# EAGLE design V1 (EAGLE 8.5.1)
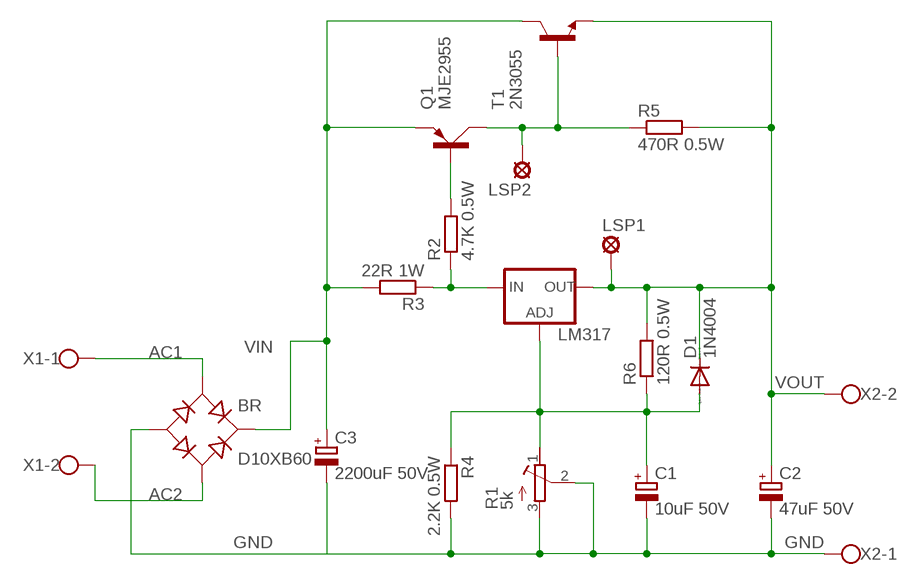
[diagram p0: schematic, sheet 1]

## Parts
BR  D10XB60  [DX10B60]
C1  10uF 50V  CPOL-EUE2.5-5  [E2,5-5]
C2  47uF 50V  CPOL-EUE5-8.5  [E5-8,5]
C3  2200uF 50V  CPOL-EUE7.5-18  [E7,5-18]
D1  1N4004  [DO41-10]
LM317  V_REG_317SINK  [TO220-ADJ]
LSP1  SE13  [SE13]
LSP2  SE13  [SE13]
Q1  MJE2955  [TO220AV]
R1  5k  R-TRIMMT93XA  [RTRIMT93XA]
R2  4.7K 0.5W  R-EU_0617/17  [0617/17]
R3  22R 1W  R-EU_0617/17  [0617/17]
R4  2.2K 0.5W  R-EU_0617/17  [0617/17]
R5  470R 0.5W  R-EU_0617/17  [0617/17]
R6  120R 0.5W  R-EU_0617/17  [0617/17]
T1  2N3055  [TO3]
X1  W237-102  [W237-102]
X2  W237-102  [W237-102]

## Nets
AC1: BR.AC1 X1.1
AC2: BR.AC2 X1.2
GND: BR.- C1.- C2.- C3.- R1.2(S) R1.3(A) R4.2 X2.1
N$2: LM317.IN R2.1 R3.1
N$3: Q1.B R2.2
N$4: LSP2.MP Q1.C R5.1 T1.B
N$6: C1.+ D1.A LM317.ADJ R1.1(E) R4.1 R6.1
VIN: BR.+ C3.+ Q1.E R3.2 T1.C T1.C/(C)
VOUT: C2.+ D1.C LM317.OUT LSP1.MP R5.2 R6.2 T1.E X2.2

## Library data of the parts
BR = dx10b60:D10XB60
C1 = rcl:CPOL-EU: POLARIZED CAPACITOR, European symbol; SPICEPREFIX: C
C2 C3 = rcl:CPOL-EU: POLARIZED CAPACITOR, European symbol
D1 = diode:1N4004: DIODE general purpose rectifier, 1 A
LM317 = SparkFun:V_REG_317: Voltage Regulator Standard LM317 adjustable voltage regulator. AOI (Adjust Output Input). Google 'LM317 Calculator' for easy to use app to get the two resistor values needed. 240/720 for 5V output. 240/390 for 3.3V output. Spark Fun Electronics SKU : COM-00527
LSP1 LSP2 = solpad:SE13: SOLDER PAD E1542, drill 1,3mm, distributor Buerklin, 07F815
Q1 = transistor-power:MJE2955: PNP TRANSISTOR
R1 = rcl:R-TRIMM: Trimm resistor; SPICEMODEL: X; SPICEPREFIXL: POT
R2-R6 = rcl:R-EU_: RESISTOR, European symbol; SPICEPREFIX: R
T1 = transistor:2N3055: NPN TRANSISTOR
X1 X2 = con-wago-500:W237-102: WAGO SCREW CLAMP; MPN: 237-102; OC_FARNELL: unknown; OC_NEWARK: 70K9898

## Board
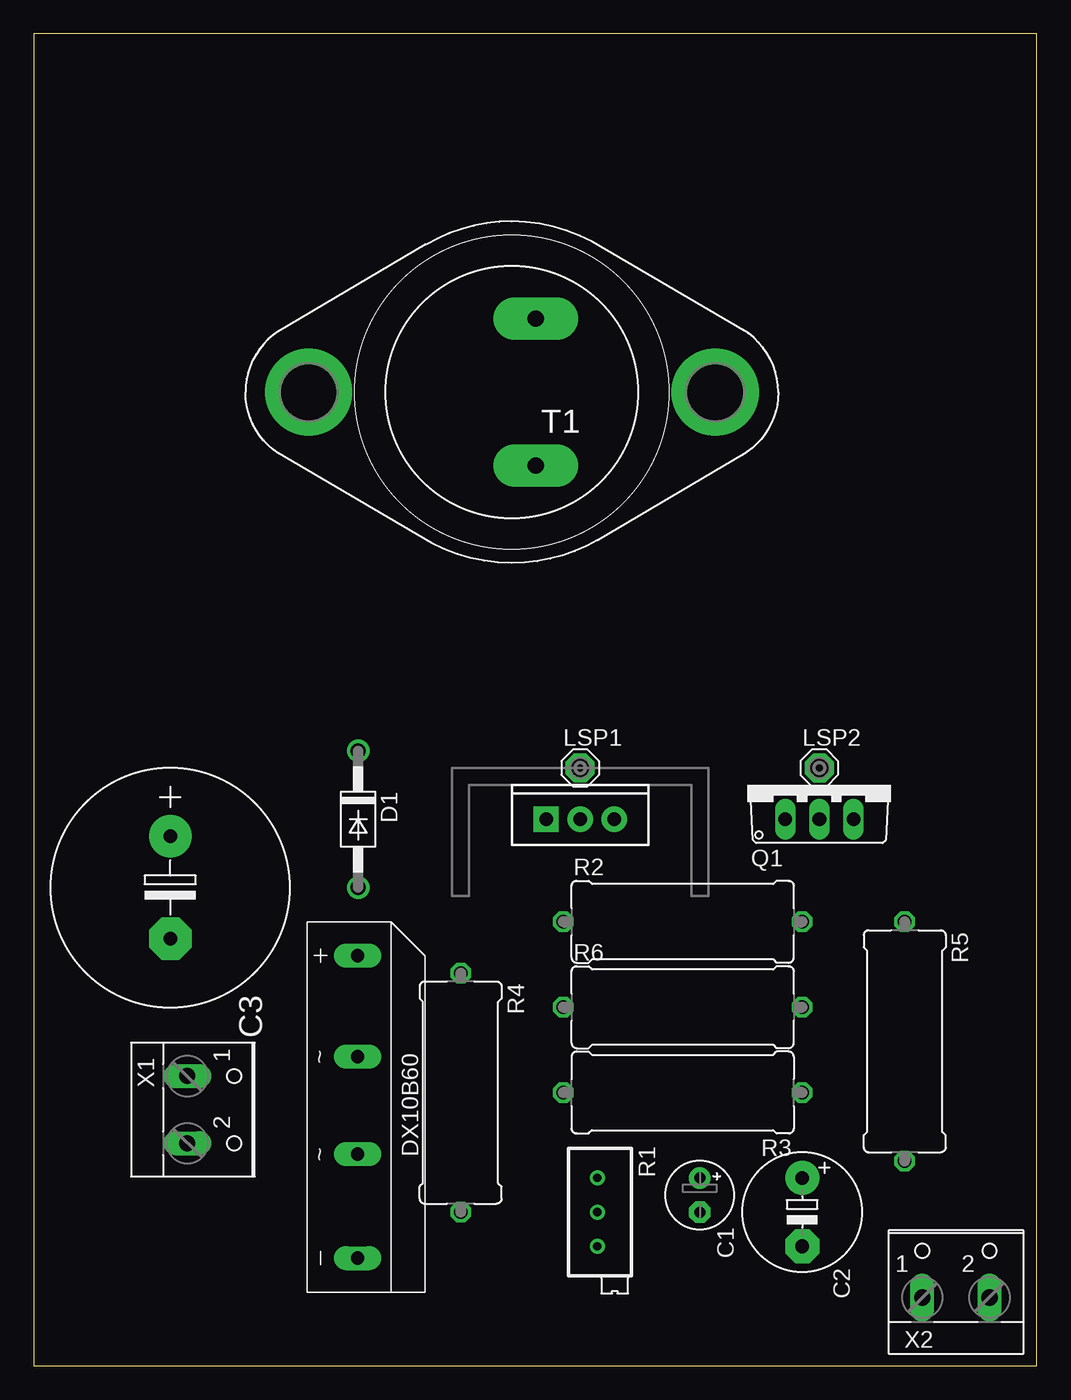
[diagram p1: board, top side]
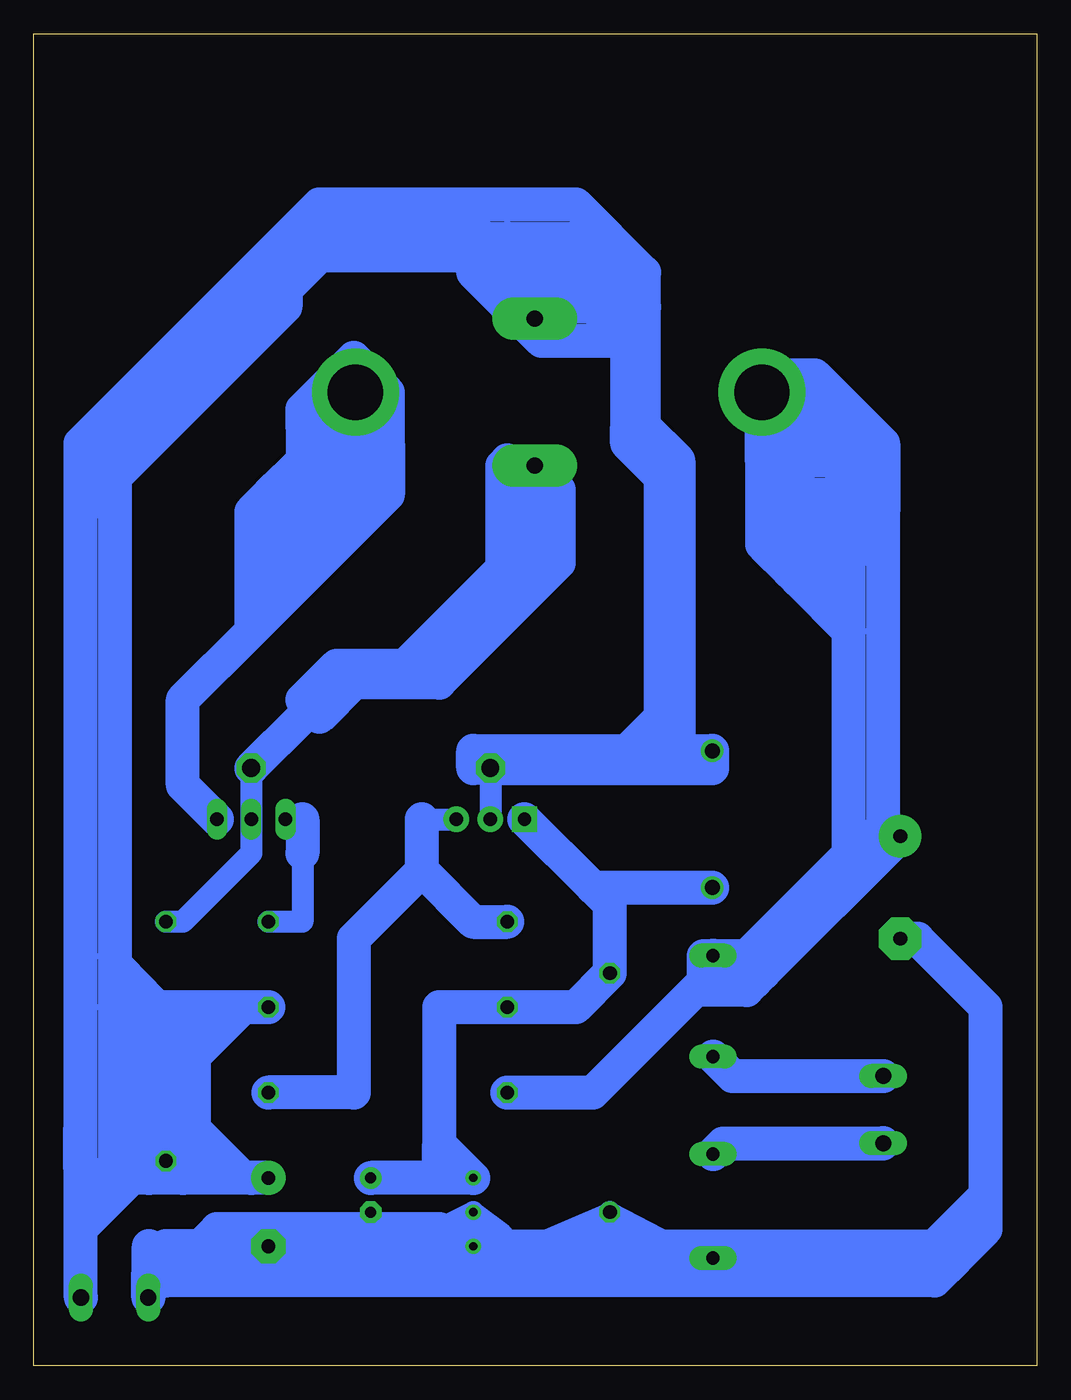
[diagram p2: board, bottom side, seen from below]

Size 74.6 x 99.05 mm. Coordinates in mm from the lower left corner, seen from the top.
Outline: 0,0 74.6,0 74.6,99.05 0,99.05 0,0
Copper layers (1*16): Top 0.035mm / dielectric 1.5mm / Bottom 0.035mm
Design rules "default": minimum track width 6mil, minimum drill 0.35mm, track to track 6mil, track to pad 6mil, pad to pad 6mil, via to via 6mil, smd to smd 6mil, copper to edge 40mil, drill to drill 6mil, minimum pad ring 10mil, minimum via ring 8mil, stop-mask expansion 4mil, vias tented up to drill 0mil, thermal gap 10mil

### Footprints (pad centres in the part's own frame; a part is rotated, then mirrored left to right if it is on the bottom)
DX10B60 = drill 1 pad 1.778 long: + 1.25,2.5; - 23.75,2.5; AC1 8.75,2.5; AC2 16,2.5
E2,5-5 = drill 0.813 pad 1.6: + -1.27,0 | drill 0.813 pad 1.6 octagon: - 1.27,0
E5-8,5 = drill 1.016 pad 2.54: + -2.54,0 | drill 1.016 pad 2.54 octagon: - 2.54,0
E7,5-18 = drill 1.016 pad 3.15: + -3.81,0 | drill 1.016 pad 3.15 octagon: - 3.81,0
DO41-10 = drill 1.118: A 5.08,0; C -5.08,0
TO220-ADJ = drill 1 pad 1.88 square: ADJ -2.54,0 | drill 1 pad 1.88: IN 2.54,0; OUT 0,0
SE13 = drill 1.321 pad 2.159 octagon: MP 0,0
TO220AV = drill 1.016 long: B -2.54,-2.54; C 0,-2.54; E 2.54,-2.54
RTRIMT93XA = drill 0.61: 1 0,-2.54; 2 0,0; 3 0,2.54
0617/17 = drill 1.016 octagon: 1 -8.89,0; 2 8.89,0
TO3 = drill 1.194 pad 3.15 long: B -1.778,5.461; E -1.778,-5.461 | drill 4.115 pad 6.477: C 15.113,0; C/ -15.113,0
W237-102 = drill 1.194 long: 1 -2.5,-1.27; 2 2.5,-1.27

### Placement (x,y rotation side)
BR  21.59,31.75 270 top
C1  49.53,12.7 270 top
C2  57.15,11.43 270 top
C3  10.16,35.56 270 top
D1  24.13,40.64 270 top
LM317  40.64,40.64 0 top
LSP1  40.64,44.45 0 top
LSP2  58.42,44.45 0 top
Q1  58.42,43.18 0 top
R1  41.91,11.43 180 top
R2  48.26,33.02 0 top
R3  48.26,20.32 180 top
R4  31.75,20.32 270 top
R5  64.77,24.13 270 top
R6  48.26,26.67 0 top
T1  35.56,72.39 180 top
X1  12.7,19.05 270 top
X2  68.58,6.35 0 top

### Tracks (layer width: path | path; a pad name or v marks a point on that pad's centre or on a via)
AC1
  Bottom 2.54: BR.AC1 22.64,21.55 X1.1
AC2
  Bottom 2.54: X1.2 11.47,16.51 23.33,16.51 BR.AC2
GND
  Bottom 1.524: BR.- 24.47,7.62 R4.2 40.64,7.62 R1.3 | C1.- 49.38,8.31 | 42.29,10.09 R1.3 | R1.3 39.37,8.89 R1.2 | R1.3 40.77,9.78 41.91,10.16
  Bottom 1.651: 40.77,9.78 39.75,9.78 R1.2 44.45,10.16 42.22,10.16 42.29,10.09 43.79,10.09 49.38,8.31 | 33.02,8.89 31.75,10.16 R4.2
  Bottom 2.54: BR.- 5.97,8 | 5.97,8 3.81,10.16 3.81,12.7 | 3.81,12.7 3.81,26.67 8.89,31.75 C3.- | 58.42,8.89 57.15,10.16 | 5.97,8 7.62,6.35 64.77,6.35 66.04,7.62 | C2.- R1.3 33.02,8.89 7.62,8.89 3.81,12.7 | 44.45,10.16 57.15,10.16 | 57.15,10.16 60.96,10.16 | 60.96,10.16 62.23,8.89 64.77,8.89 | 66.04,7.62 66.04,8.89 X2.1 64.77,8.89 | 66.04,7.62 59.69,7.62 59.69,8.89 | 66.04,7.62 64.77,8.89 | 60.96,10.16 58.42,8.89 | 58.42,8.89 C2.- | C2.- 57.15,10.16
N$2
  Bottom 1.651: 45.72,40.64 LM317.IN
  Bottom 2.54: 45.72,36.83 45.72,40.64 | 45.72,36.83 41.91,33.02 R2.1 | 45.72,36.83 50.8,31.75 50.8,20.32 R3.1
N$3
  Bottom 1.524: Q1.B 54.61,40.64
  Bottom 1.651: 54.61,38.1 54.61,33.02 R2.2
  Bottom 2.54: 54.61,40.64 54.61,38.1
N$4
  Bottom 1.651: LSP2.MP Q1.C 58.42,38.1 63.5,33.02 R5.1 | 53.98,48.9 54.61,49.53 54.61,48.26
  Bottom 2.54: T1.B 39.36,60.55 39.75,59.31 | 39.75,59.31 46.99,52.07 | 46.99,52.07 44.45,52.07 37.34,59.18 T1.B | LSP2.MP 54.61,48.26 53.98,48.9 53.34,48.26 50.8,50.8 44.45,50.8 35.56,59.69 35.56,65.15 T1.B | 39.75,59.31 39.75,66.93 39.37,67.31 | 54.61,49.53 52.07,52.07 46.99,52.07
N$6
  Bottom 2.54: LM317.ADJ 33.02,35.56 | 33.02,35.56 D1.A | 33.02,35.56 31.75,34.29 R4.1 34.29,26.67 R6.1 44.45,26.67 44.45,16.51 | 44.45,15.24 44.45,16.51 | 44.45,16.51 R1.1 C1.+
VIN
  Bottom 1.651: 57.15,64.77 52.07,64.77 50.8,64.77 T1.C/
  Bottom 2.54: 21.57,29.21 13.95,36.83 | 13.95,36.83 13.97,39.37 | 11.43,39.37 C3.+ 20.32,29.21 | 13.97,39.37 13.97,54.61 | 13.97,54.61 13.97,59.69 17.78,63.5 | 17.78,63.5 20.32,66.04 | 20.32,66.04 20.32,71.12 | 20.32,66.04 20.32,63.5 | T1.C 20.45,61.09 20.32,60.96 | 15.88,59.05 17.78,60.96 20.32,60.96 | 15.88,59.05 15.22,58.4 | 13.95,36.83 13.95,38.1 21.58,30.47 21.58,29.2 | T1.C 17.91,67.31 | 15.24,67.31 17.91,67.31 | 11.43,63.5 13.34,65.41 | 13.34,65.41 13.97,66.04 | 13.97,66.04 15.24,67.31 | 11.43,39.37 11.43,63.5 | 17.91,67.31 20.32,67.31 20.45,67.18 T1.C | T1.C 19.05,64.77 17.78,66.04 | 17.78,63.5 15.24,63.5 12.7,60.96 | 13.34,65.41 13.97,64.77 15.24,64.77 | 17.78,64.77 15.24,64.77 | 15.24,64.77 12.7,62.23 | 20.32,60.96 19.05,62.23 | 21.58,29.2 BR.+ 24.13,30.46 24.13,29.21 | 55.88,66.04 51.94,66.04 51.51,68.21 | T1.C/ 51.51,68.21 | 50.8,62.23 50.8,64.77 | Q1.E 63.5,43.18 63.5,49.53 58.42,54.61 | 54.61,58.42 52.07,60.96 | 52.07,60.96 50.8,62.23 | 58.42,54.61 58.42,63.5 57.15,64.77 55.88,66.04 | 58.42,54.61 54.61,58.42 | 54.61,62.23 55.88,63.5 57.15,63.5 57.15,57.15 | 54.61,58.42 54.61,62.23 | T1.C/ 50.67,62.36 | 50.67,62.36 50.8,62.23 | 50.67,62.36 48.26,64.77 48.26,68.58 | 54.61,67.31 49.53,67.31 48.26,68.58 | 54.61,67.31 55.88,66.04 | 54.61,62.23 55.88,62.23 54.61,63.5 | 54.61,63.5 52.07,63.5 52.07,64.77 | 52.07,60.96 54.61,63.5 | 54.61,69.85 54.61,67.31 | 51.51,68.21 53.15,69.85 53.34,69.85 | 13.97,39.37 11.43,39.37 | T1.C 19.18,73.66 16.51,73.66 11.43,68.58 11.43,63.5 | 13.97,66.04 12.7,67.31 | 15.24,67.31 17.78,69.85 | 17.78,69.85 17.78,71.12 16.51,71.12 13.97,68.58 | 20.32,60.96 18.41,59.05 | 18.41,59.05 17.78,58.42 | 17.78,58.42 16.51,58.42
  Bottom 2.54: 15.88,59.05 18.41,59.05 | 17.78,58.42 13.97,54.61 | T1.C 20.32,72.39 17.78,69.85 | T1.C/ 49.53,73.53 49.53,73.66 | T1.C/ 50.67,74.8 | 50.67,74.8 50.8,74.93 54.61,71.12 54.61,69.85 | 50.67,74.8 48.26,72.39 48.26,68.58 | T1.C/ 51.94,73.66 52.07,73.66 | T1.C/ 52.07,72.39 54.61,69.85 | 20.32,29.21 20.95,28.57 21.59,27.94 25.4,27.94 | 21.59,30.48 24.77,30.48 24.77,28.57 | R3.2 33.02,20.32 25.4,27.94 | 24.77,28.57 24.13,29.21 | 21.58,29.2 24.12,29.2 24.13,29.21 | 21.58,29.2 21.57,29.21 | 21.57,29.21 20.32,29.21 | 25.4,27.94 24.77,28.57
VOUT
  Bottom 1.651: LSP1.MP LM317.OUT | 58.42,13.97 62.23,17.78 | 62.23,17.78 62.23,22.86 | 62.23,22.86 62.23,25.4 | 62.23,17.78 62.23,16.51 | 62.23,16.51 60.96,15.24 | 62.23,16.51 62.87,17.14 | 62.87,17.14 63.5,17.78 | 63.5,17.78 63.5,25.4 | 63.5,13.97 63.5,16.51 | 63.5,17.78 63.5,16.51 | 63.5,16.51 62.23,15.24 | 62.87,17.14 63.5,16.51 | 63.5,16.51 66.04,16.51 | 67.31,16.51 66.04,16.51 | 66.04,16.51 67.31,15.24 68.58,15.24 68.58,13.97 71.1,11.45 71.1,11.43 | 66.04,13.97 66.04,16.51 | 66.04,16.51 64.77,17.78 64.77,19.05 | 64.77,19.05 64.77,20.32 | 64.77,20.32 64.77,21.59 | 64.77,21.59 64.77,22.86 | 64.77,22.86 64.77,24.13 | 64.77,24.13 64.77,25.4 | 67.31,26.67 67.31,22.86 | 67.31,22.86 67.31,20.32 | 67.31,20.32 67.31,16.51 | 67.31,16.51 64.77,19.05 | 64.77,20.32 66.04,19.05 | 64.77,21.59 66.04,20.32 66.04,21.59 67.31,22.86 | 64.77,22.86 67.31,20.32 | 64.77,24.13 66.04,22.86 66.04,25.4 | 59.69,26.67 59.69,25.4 | 59.69,25.4 62.23,22.86 | 58.42,26.67 59.69,25.4 | 60.96,26.67 60.96,25.4 | 64.77,26.67 67.31,29.21 | 68.58,30.48 67.31,29.21 | 67.31,29.21 67.31,27.94
  Bottom 2.54: 27.94,48.26 27.94,45.72 | 27.94,45.72 D1.C | 29.91,70.42 26.67,67.31 | 26.67,67.31 26.67,45.72 D1.C | 30.48,45.72 41.91,45.72 41.91,44.45 LSP1.MP 24.13,44.45 D1.C | 30.48,45.72 27.94,45.72 | 30.48,45.72 27.94,48.26 | 57.15,80.01 61.68,74.48 | 61.68,74.48 63.94,71.71 | 63.94,71.71 68.58,66.04 | 55.88,78.74 68.58,66.04 | 68.58,66.04 68.58,30.48 68.58,26.67 | 68.58,26.67 68.58,15.24 | 68.58,66.04 71.12,63.5 | 71.12,63.5 71.12,17.74 | X2.2 71.1,10.16 | 71.1,10.16 71.1,11.43 71.12,17.74 | 71.12,17.74 71.12,13.97 68.58,13.97 71.1,11.45 71.1,10.18 | 29.21,69.85 26.67,67.31 | 30.48,76.2 30.48,78.74 33.02,78.74 | 30.48,69.85 30.48,68.58 27.94,66.04 27.94,48.26 | 30.48,76.2 33.02,78.74 | 30.48,76.2 30.48,69.85 | 29.21,69.85 29.21,68.58 30.48,69.85 | 29.21,69.85 29.21,78.74 | 29.21,78.74 30.48,80.01 | 30.48,80.01 39.5,80.01 T1.E 36.45,78.74 33.02,78.74 | 55.88,78.74 57.15,78.74 | 57.15,78.74 58.42,80.01 | 58.42,80.01 57.15,80.01 | 58.42,80.01 59.69,80.01 | 59.69,80.01 71.12,68.58 71.12,63.5 | 68.58,66.04 69.85,66.04 69.85,68.58 64.77,73.66 64.77,72.54 63.94,71.71 | 61.68,74.48 62.13,74.93 62.23,74.93 63.5,73.66 | 59.69,80.01 53.34,86.36 50.8,86.36 | 50.8,86.36 34.29,86.36 29.21,81.28 29.21,78.74 | 30.48,76.2 36.83,76.2 41.91,81.28 | 41.91,81.28 41.91,83.82 | 41.91,83.82 41.91,85.09 | 55.88,78.74 55.88,80.01 53.34,82.55 43.18,82.55 41.91,83.82 | 57.15,78.74 57.15,80.01 | 57.15,80.01 52.7,84.45 | 52.7,84.45 50.8,86.36 | 52.7,84.45 42.55,84.45 41.91,83.82 | 41.91,83.82 39.37,83.82 | 39.37,83.82 34.29,83.82 30.48,80.01 | 39.37,83.82 39.37,82.55 40.64,81.28 | 40.64,81.28 41.91,81.28 | 40.64,81.28 33.02,81.28 | R6.2 58.42,26.67 59.69,26.67 60.96,26.67 64.77,26.67 67.31,26.67 68.58,26.67
  Bottom 2.54: C2.+ 58.42,13.97 63.5,13.97 | 63.5,13.97 R5.2 | 63.5,13.97 66.04,13.97 67.31,13.97 71.1,10.18 | 71.1,10.18 71.1,10.16